# EAGLE design cube_gears_motor_controller (EAGLE 5.11)
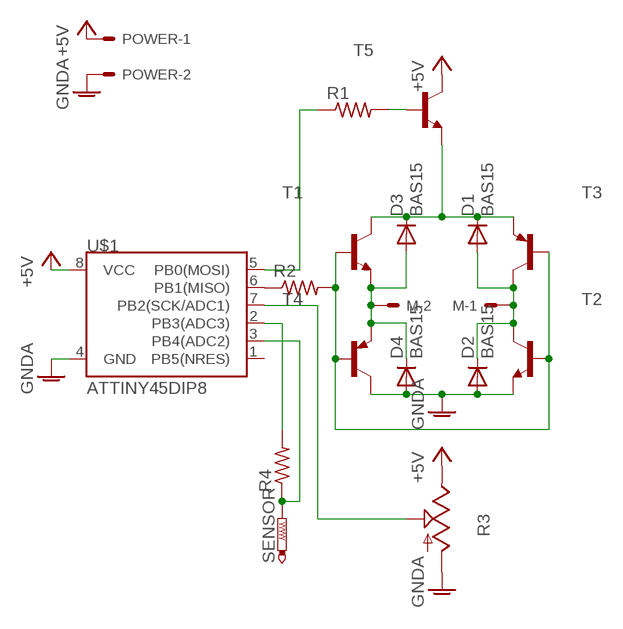
[diagram p0: schematic, sheet 1]

## Parts
D1  BAS15  [DO34-7]
D2  BAS15  [DO34-7]
D3  BAS15  [DO34-7]
D4  BAS15  [DO34-7]
M  KK-156-2  [KK-156-2]
POWER  KK-156-2  [KK-156-2]
R1  R-US_0204/7  [0204/7]
R2  R-US_0204/7  [0204/7]
R3  TRIM_US-CIP20C-4MM  [CIP20C-4MM]
R4  R-US_0204/7  [0204/7]
SENSOR  PTR1PAD1-13Y  [P1-13Y]
T1  -NPN-TO92-EBC  [TO92-EBC]
T2  -NPN-TO92-EBC  [TO92-EBC]
T3  -PNP-TO92-BCE  [TO92-BCE]
T4  -PNP-TO92-BCE  [TO92-BCE]
T5  -NPN-TO92-EBC  [TO92-EBC]
U$1  ATTINY45DIP8  [DIP08]

## Nets
+5V: POWER.1 R3.E T5.C U$1.8(VCC)
GNDA: D2.A D4.A POWER.2 R3.A T2.E T4.C U$1.4(GND)
N$1: R1.2 T5.B
N$2: D1.C D3.C T1.C T3.E T5.E
N$3: D3.A D4.C M.2 T1.E T4.E
N$4: D1.A D2.C M.1 T2.C T3.C
N$5: R2.1 U$1.6(PB1(MISO))
N$6: R3.S U$1.7(PB2(SCK/ADC1))
N$7: R2.2 T1.B T2.B T3.B T4.B
N$8: R1.1 U$1.5(PB0(MOSI))
N$9: R4.1 SENSOR.TP U$1.3(PB4(ADC2))
N$10: R4.2 U$1.2(PB3(ADC3))
Unconnected: U$1.1(PB5(NRES))

## Library data of the parts
D1-D4 = diode:BAS15: DIODE high speed
M POWER = con-molex:KK-156-2: KK 156 HEADER Source: http://www.molex.com/pdm_docs/sd/026604100_sd.pdf; OC_FARNELL: unknown; OC_NEWARK: unknown
R1 R2 R4 = rcl:R-US_: RESISTOR, American symbol
R3 = pot:TRIM_US-: POTENTIOMETER
SENSOR = testpad:PTR1: TEST PIN
T1 T2 T5 = transistor:*-NPN-: NPN Transistror BF959 corrected 2008.03.06
T3 T4 = transistor-neu-to92:*-PNP-: PNP Transistror
U$1 = SparkFun:ATTINY45: Atmel ATTiny45

## Board
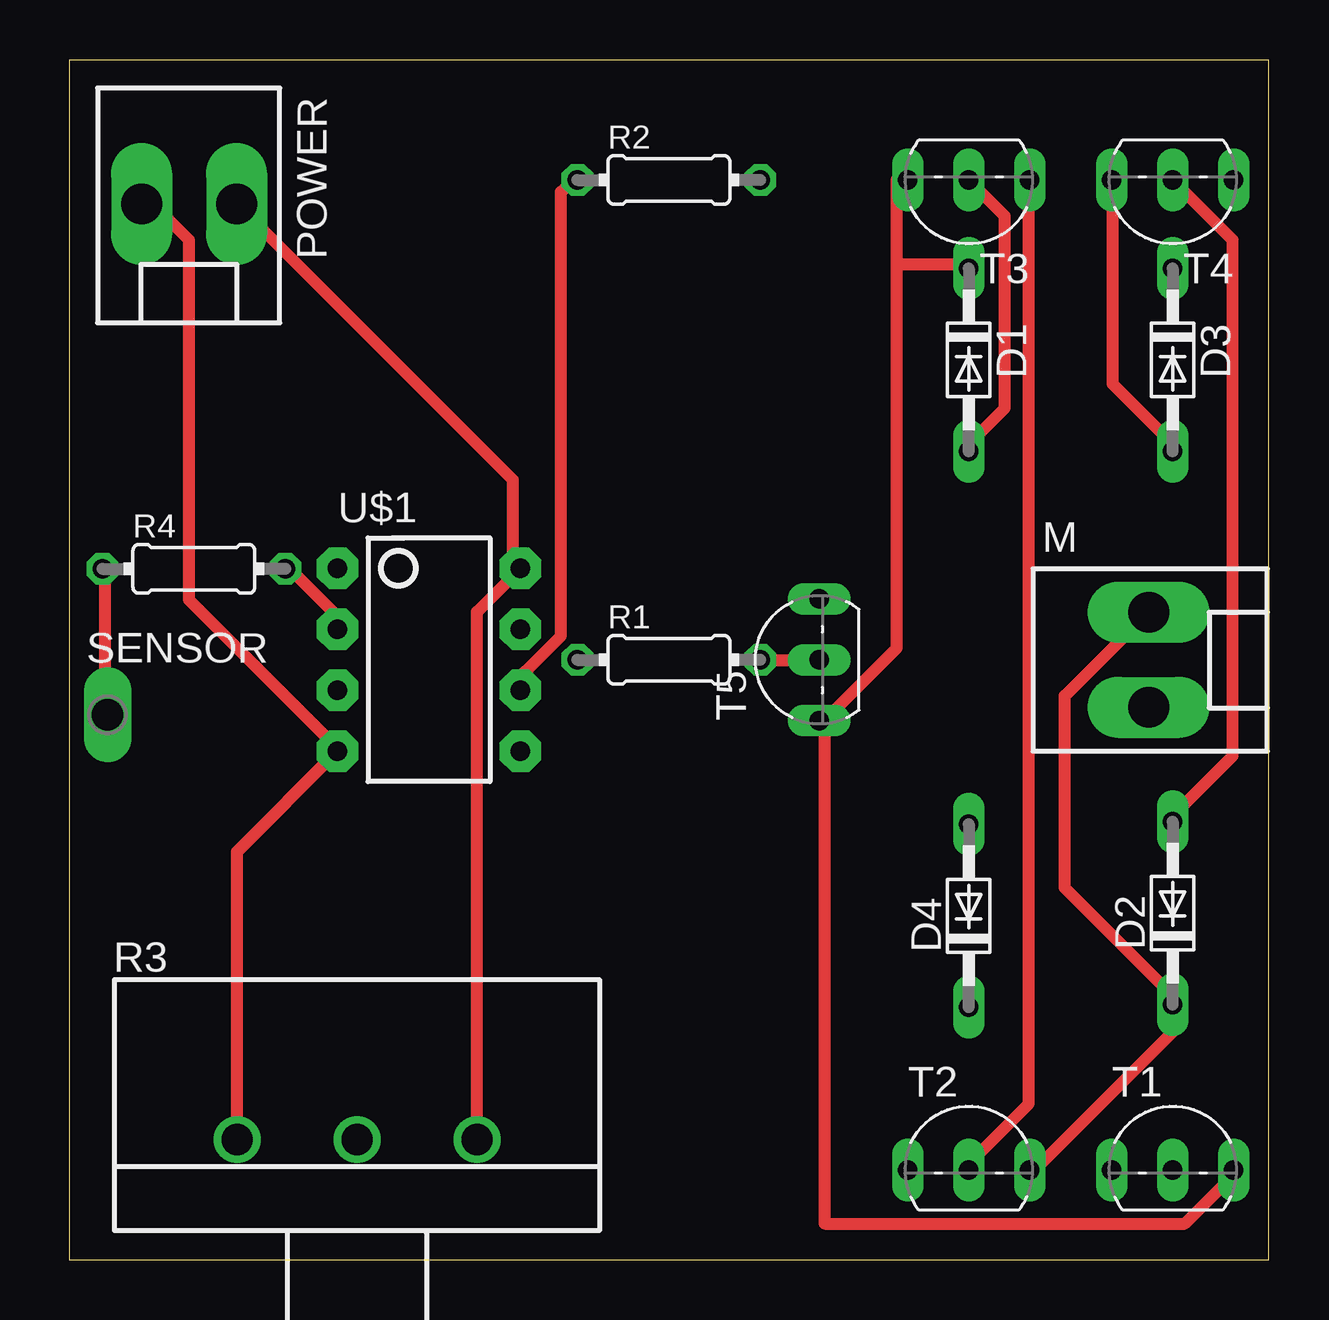
[diagram p1: board, top side]
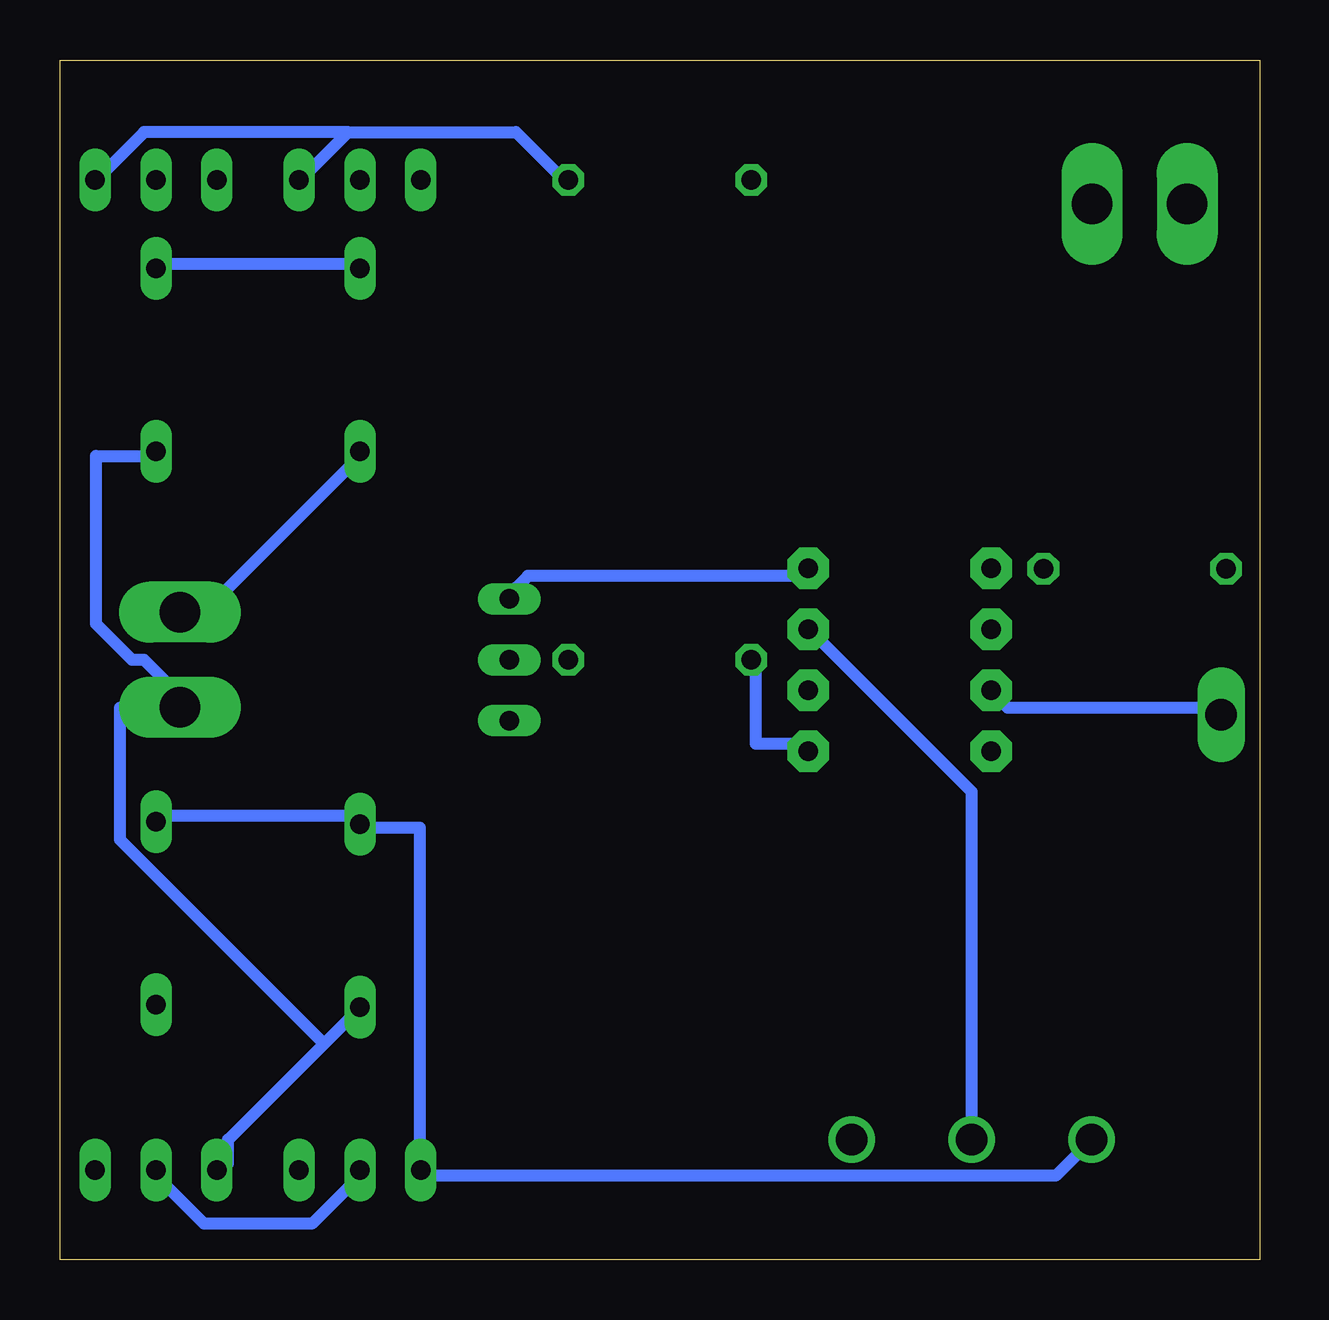
[diagram p2: board, bottom side, seen from below]

Size 50 x 50 mm. Coordinates in mm from the lower left corner, seen from the top.
Outline: 0,0 50,0 50,50 0,50 0,0
Copper layers (1*16): Top 0.035mm / dielectric 1.5mm / Bottom 0.035mm
Design rules "default *": minimum track width 20mil, minimum drill 24mil, track to track 8mil, track to pad 8mil, pad to pad 8mil, via to via 8mil, smd to smd 8mil, copper to edge 40mil, drill to drill 8mil, minimum pad ring 10mil, minimum via ring 8mil, stop-mask expansion 4mil, vias tented up to drill 0mil, thermal gap 10mil

### Footprints (pad centres in the part's own frame; a part is rotated, then mirrored left to right if it is on the bottom)
DO34-7 = drill 0.813 long: A 3.81,0; C -3.81,0
KK-156-2 = drill 1.7 pad 2.184 long: 1 -1.98,0; 2 1.98,0
0204/7 = drill 0.813 octagon: 1 -3.81,0; 2 3.81,0
CIP20C-4MM = drill 1.3 pad 1.93 round: A -5,0; E 5,0; S 0,0
P1-13Y = drill 1.321 pad 1.905 long: TP 0,0
TO92-EBC = drill 0.813 long: B 0,-1.27; C 2.54,-1.27; E -2.54,-1.27
TO92-BCE = drill 0.813 long: B -2.54,0; C 0,0; E 2.54,0
DIP08 = drill 0.813 pad 1.727 octagon: 1 -3.81,-3.81; 2 -1.27,-3.81; 3 1.27,-3.81; 4 3.81,-3.81; 5 3.81,3.81; 6 1.27,3.81; 7 -1.27,3.81; 8 -3.81,3.81

### Placement (x,y rotation side)
D1  37.5,37.5 270 top
D2  46,14.44 90 top
D3  46,37.5 270 top
D4  37.5,14.33 90 top
M  45,25 270 top
POWER  5,44 180 top
R1  25,25 0 top
R2  25,45 0 top
R3  12,5 0 top
R4  5.2,28.79 0 top
SENSOR  1.6,22.71 0 top
T1  46,5 0 top
T2  37.5,5 0 top
T3  37.5,45 180 top
T4  46,45 180 top
T5  30,25 90 top
U$1  15,25 270 top

### Tracks (layer width: path | path; a pad name or v marks a point on that pad's centre or on a via)
+5V
  Top 0.508: R3.E 17,27 U$1.8 18.5,29 18.5,32.5 7,44 POWER.1
  Bottom 0.508: T5.C 31,28 30.5,28.5 19,28.5 U$1.8
GNDA
  Top 0.508: R3.A 7,17 U$1.4 11,21.5 5,27.5 5,42.5 3.5,44 POWER.2 | T4.C 48.5,42.5 48.5,21 46,18.5 D2.A
  Bottom 0.508: D2.A 46,18.5 37.5,18.5 D4.A 37.5,18 35,18 35,4 T2.E 34.5,3.5 8.5,3.5 R3.A
N$1
  Top 0.508: R1.2 T5.B
N$2
  Top 0.508: 34.5,41.5 34.5,45 T3.E | 34.5,41.5 34.5,25.5 31.5,22.5 T5.E 31.5,22 31.5,1.5 46.5,1.5 48.5,3.5 T1.C | 34.5,41.5 37.5,41.5 D1.C
  Bottom 0.508: D3.C 46,41.5 37.5,41.5 D1.C
N$3
  Top 0.508: D3.A 46,34 43.5,36.5 43.5,45 T4.E
  Bottom 0.508: 39,9 43,5 43,4 T1.E | 39,9 37.5,10.5 D4.C | D3.A 46,33.5 48.5,33.5 48.5,26.5 47,25 46.5,25 45,23.5 M.2 45,23 47.5,23 47.5,17.5 39,9
N$4
  Top 0.508: T2.C 40.5,4 46,9.5 D2.C 46,11 41.5,15.5 41.5,23.5 45,27 M.1 | T3.C 39,43.5 39,35.5 37.5,34 D1.A
  Bottom 0.508: D1.A 37.5,33.5 44,27 45,27 M.1
N$5
  Top 0.508: R2.1 21,45 20.5,44.5 20.5,26 19,24.5 19,24 U$1.6
N$6
  Bottom 0.508: R3.S 12,19.5 18.5,26 U$1.7
N$7
  Top 0.508: T2.B 37.5,4 40,6.5 40,45 T3.B
  Bottom 0.508: T2.B 37.5,3.5 39.5,1.5 44,1.5 46,3.5 T1.B | 38,47 31,47 29,45 R2.2 | 38,47 40,45 T3.B | 38,47 46.5,47 48.5,45 T4.B
N$8
  Bottom 0.508: R1.1 21,25 21,21.5 19,21.5 U$1.5
N$9
  Top 0.508: R4.1 1.5,28.5 1.5,23 SENSOR.TP
  Bottom 0.508: U$1.3 11,23.5 10.5,23 2,23 SENSOR.TP
N$10
  Top 0.508: R4.2 9.5,28.5 11,27 11,26.5 U$1.2